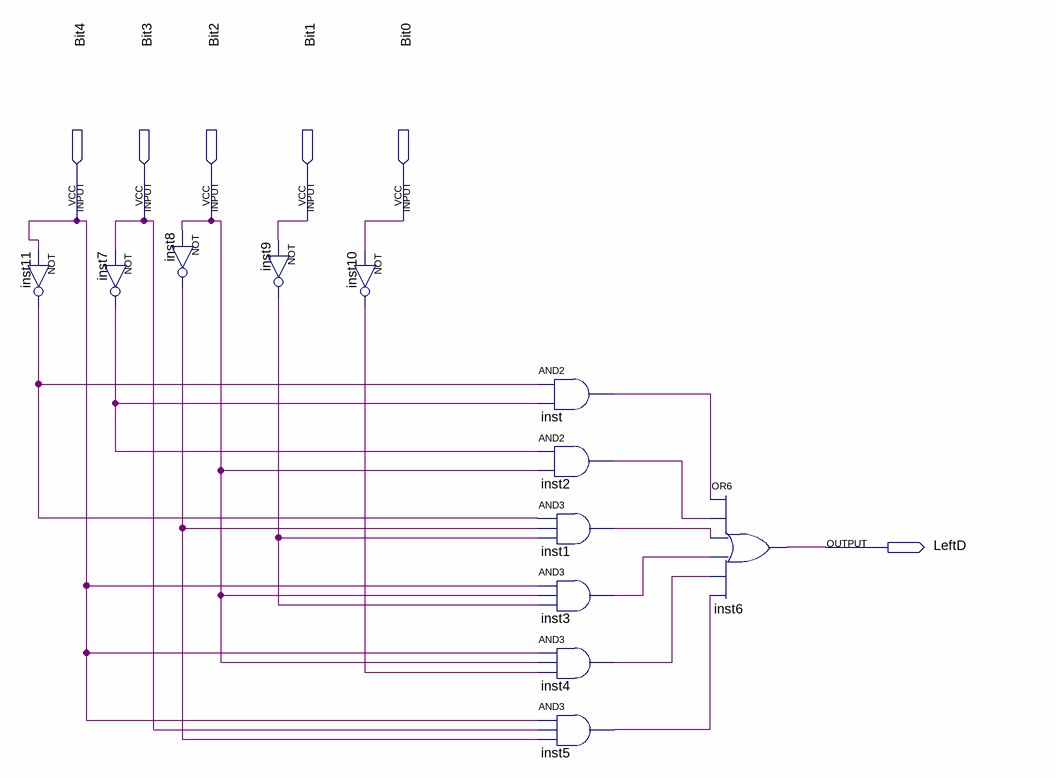
[diagram p0: schematic sheet]
// Quartus schematic LeftD.bdf as structural Verilog: 12 symbols, 6 pins
module LeftD (
  input  Bit4,
  input  Bit3,
  input  Bit2,
  input  Bit1,
  input  Bit0,
  output LeftD
);

  wire inst1_out, inst2_out, inst3_out, inst4_out, inst5_out, inst7_out, inst8_out, inst9_out, inst10_out,
       inst11_out, inst_out;

  not inst11 (inst11_out, Bit4);
  not inst7 (inst7_out, Bit3);
  not inst8 (inst8_out, Bit2);
  not inst9 (inst9_out, Bit1);
  not inst10 (inst10_out, Bit0);
  and inst (inst_out, inst11_out, inst7_out);
  and inst2 (inst2_out, inst7_out, Bit2);
  and inst1 (inst1_out, inst11_out, inst8_out, inst9_out);
  and inst3 (inst3_out, Bit4, Bit2, inst9_out);
  and inst4 (inst4_out, Bit4, Bit2, inst10_out);
  and inst5 (inst5_out, Bit4, Bit3, inst8_out);
  or inst6 (LeftD, inst_out, inst2_out, inst1_out, inst3_out, inst4_out, inst5_out);
endmodule
